# EAGLE design displayboard (EAGLE 6.4)
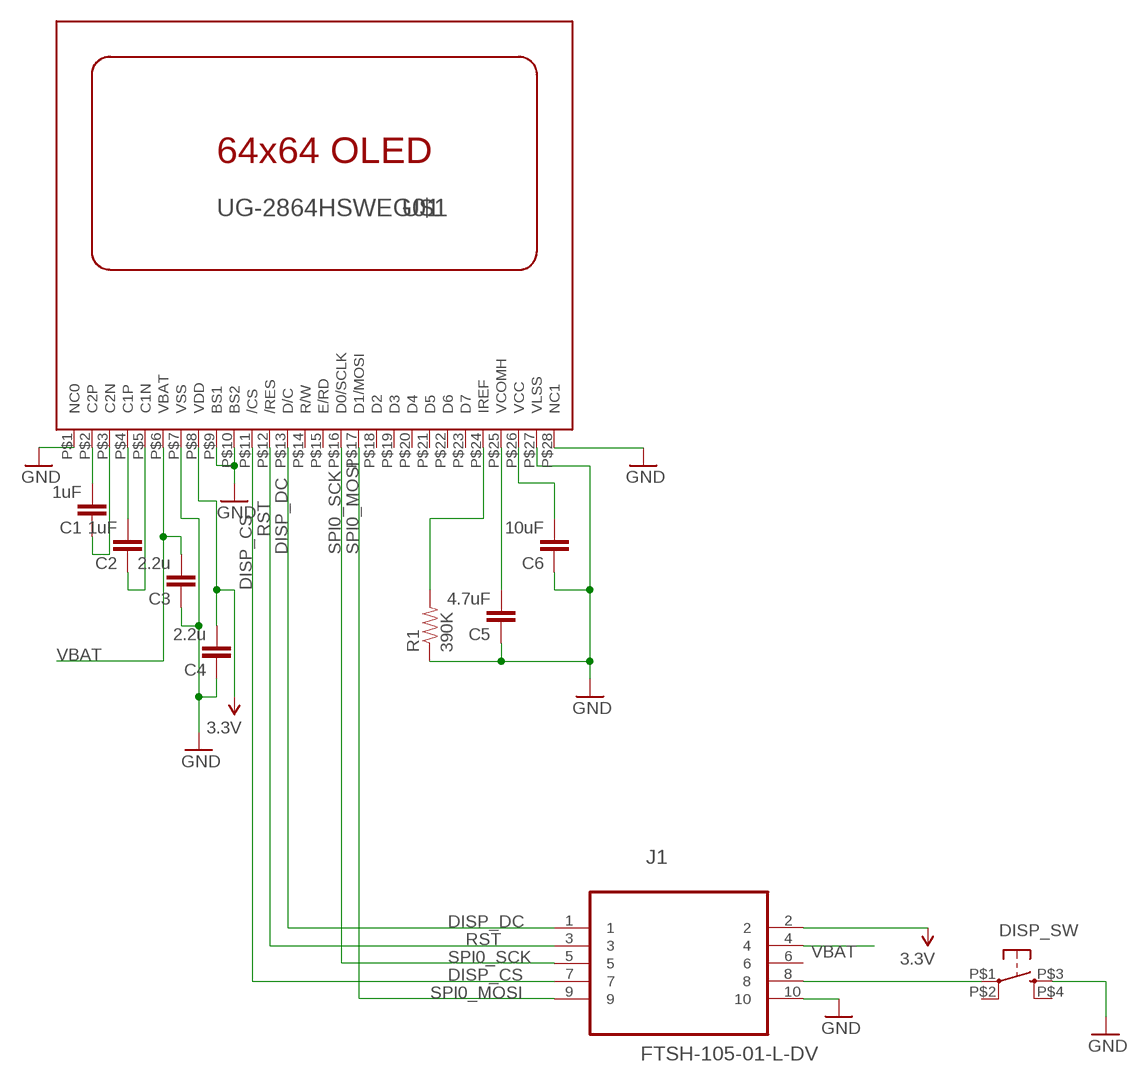
[diagram p0: schematic, sheet 1]

## Parts
C1  1uF  CAP0805  [0805]
C2  1uF  CAP0805  [0805]
C3  2.2u  CAP0805  [0805]
C4  2.2u  CAP0805  [0805]
C5  4.7uF  CAP0805  [0805]
C6  10uF  CAP0805  [0805]
DISP_SW  TAC_SWITCHKSA_SEALED  [KSA_SEALED_TAC_SWITCH]
J1  FTSH-105-01-L-DV  [SAMTEC_FTSH-105-01-L-DV]
R1  390K  RESISTOR0805-RES  [0805]
U$1  UG-2864HSWEG01  [1X28-0.32MM]

## Nets
3.3V: C4.2 J1.2 U$1.P$8(VDD)
DISP_CS: J1.7 U$1.P$11(/CS)
DISP_DC: J1.1 U$1.P$13(D/C)
DISP_SW: DISP_SW.P$1 J1.8
GND: C3.1 C4.1 C5.1 C6.1 DISP_SW.P$3 J1.10 R1.1 U$1.P$1(NC0) U$1.P$7(VSS) U$1.P$9(BS1) U$1.P$10(BS2) U$1.P$27(VLSS) U$1.P$28(NC1)
N$2: C2.1 U$1.P$5(C1N)
N$3: R1.2 U$1.P$24(IREF)
N$25: C1.2 U$1.P$2(C2P)
N$26: C6.2 U$1.P$26(VCC)
N$27: C1.1 U$1.P$3(C2N)
N$28: C5.2 U$1.P$25(VCOMH)
N$29: C2.2 U$1.P$4(C1P)
RST: J1.3 U$1.P$12(/RES)
SPI0_MOSI: J1.9 U$1.P$17(D1/MOSI)
SPI0_SCK: J1.5 U$1.P$16(D0/SCLK)
VBAT: C3.2 J1.4 U$1.P$6(VBAT)
Unconnected: DISP_SW.P$2 DISP_SW.P$4 J1.6 U$1.P$14(R/W) U$1.P$15(E/RD) U$1.P$18(D2) U$1.P$19(D3) U$1.P$20(D4) U$1.P$21(D5) U$1.P$22(D6) U$1.P$23(D7)

## Library data of the parts
C1-C6 = SparkFun-Capacitors:CAP: Capacitor Standard 0603 ceramic capacitor, and 0.1" leaded capacitor.
DISP_SW = SparkFun-Electromechanical:TAC_SWITCH: Momentary Switch Button commonly used for reset or general input. Spark Fun Electronics SKU : COM-00097 SMT- SWCH-08247
J1 = SAMTEC-HTSW-FTxx_By_element14_Batch_1:FTSH-105-01-L-DV: CONN HEADER, 1.27MM, 2X5WAY, SMT; MPN: FTSH-105-01-L-DV; OC_FARNELL: 1667759; OC_NEWARK: 11P4814; PACKAGE: HEADER, 1.27MM, 2X5WAY, SMT; SUPPLIER: SAMTEC
R1 = SparkFun-Passives:RESISTOR: Resistor Basic schematic elements and footprints for 0603, 1206, and PTH resistors.
U$1 = adafruit:UG-2864HSWEG01: UG-2864HSWEG01 OLED display

## Board
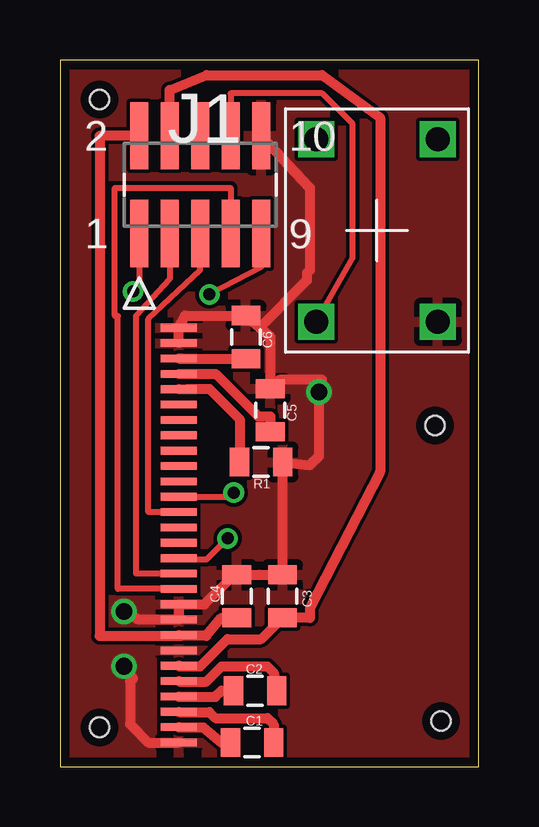
[diagram p1: board, top side]
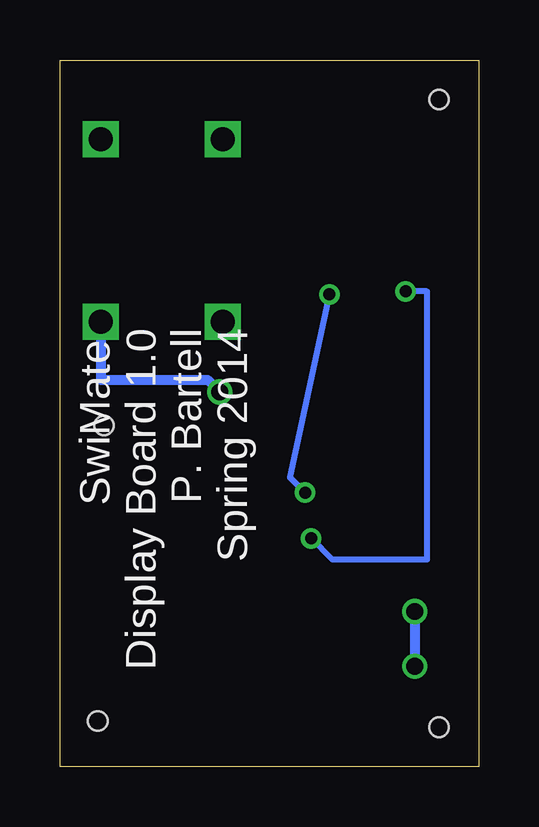
[diagram p2: board, bottom side, seen from below]

Size 17.45 x 29.45 mm. Coordinates in mm from the lower left corner, seen from the top.
Outline: 0,0 17.45,0 17.45,29.45 0,29.45 0,0
Copper layers (1*16): Top 0.0356mm / dielectric 1.5011mm / Bottom 0.0356mm
Design rules "LaenPCBOrder": minimum track width 6mil, minimum drill 13mil, track to track 6mil, track to pad 6mil, pad to pad 6mil, via to via 6mil, smd to smd 6mil, copper to edge 15mil, drill to drill 6mil, minimum pad ring 7mil, minimum via ring 7mil, stop-mask expansion 3mil, vias tented up to drill 0mil, thermal gap 10mil
Holes 0.8 mm at 1.65,1.65 15.88,1.91 15.62,14.22 1.65,27.81

### Footprints (pad centres in the part's own frame; a part is rotated, then mirrored left to right if it is on the bottom)
0805 = smd 0.8 x 1.2: 1 -0.9,0; 2 0.9,0
KSA_SEALED_TAC_SWITCH = drill 1 square: P$1 -3.81,2.54; P$2 3.81,2.54; P$3 -3.81,-2.54; P$4 3.81,-2.54
SAMTEC_FTSH-105-01-L-DV = smd 0.762 x 2.794: 1 -2.54,-2.032; 2 -2.54,2.032; 3 -1.27,-2.032; 4 -1.27,2.032; 5 0,-2.032; 6 0,2.032; 7 1.27,-2.032; 8 1.27,2.032; 9 2.54,-2.032; 10 2.54,2.032
1X28-0.32MM = smd 0.32 x 1.5: P$1 0,0; P$2 0.64,0; P$3 1.28,0; P$4 1.92,0; P$5 2.56,0; P$6 3.2,0; P$7 3.84,0; P$8 4.48,0; P$9 5.12,0; P$10 5.76,0; P$11 6.4,0; P$12 7.04,0; P$13 7.68,0; P$14 8.32,0; P$15 8.96,0; P$16 9.6,0; P$17 10.24,0; P$18 10.88,0; P$19 11.52,0; P$20 12.16,0; P$21 12.8,0; P$22 13.44,0; P$23 14.08,0; P$24 14.72,0; P$25 15.36,0; P$26 16,0; P$27 16.64,0; P$28 17.28,0

### Placement (x,y rotation side)
C1  8,1.02 180 top
C2  8.13,3.17 180 top
C3  9.27,7.11 270 top
C4  7.37,7.11 270 top
C5  8.76,14.86 270 top
C6  7.75,17.91 270 top
DISP_SW  13.21,22.35 90 top
J1  5.84,24.26 0 top
R1  8.38,12.7 180 top
U$1  4.95,1.02 90 top

### Tracks (layer width: path | path; a pad name or v marks a point on that pad's centre or on a via)
3.3V
  Top 0.406: C4.2 6.72,6.21 6.1,5.46 5.04,5.46 U$1.P$8 4.95,5.46 1.65,5.46 1.65,26.29 J1.2
DISP_CS
  Top 0.254: U$1.P$11 2.41,7.42 2.41,18.8 2.29,18.8 2.29,24.13 7.11,24.13 J1.7
DISP_DC  (via drill 0.5)
  Top 0.254: J1.1 3.3,19.81 v3.05,19.81 | v6.99,9.53 6.1,8.64 5.01,8.64 U$1.P$13
  Bottom 0.254: v3.05,19.81 2.16,19.81 2.16,8.64 6.1,8.64 v6.99,9.53
DISP_SW
  Top 0.254: DISP_SW.P$1 12.19,21.21 12.19,26.8 10.92,28.07 7.11,28.07 J1.8
GND  (via drill 0.7)
  Top 0.406: U$1.P$27 U$1.P$28 5.21,18.81 C6.1 8.32,18.31 | 8.32,18.31 8.76,17.92 C5.1 9.13,16.13 10.92,16.13 10.79,16 v10.79,15.62 10.79,12.95 10.41,12.57 R1.1 9.27,12.56 C3.1 C4.1 7.25,8.01 6.01,6.78 U$1.P$10 U$1.P$9 3.26,6.14 v2.67,6.48 | J1.10 10.41,24.13 10.41,20.7 10.29,20.57 10.29,20.28 8.32,18.31 | v2.67,4.19 3.05,3.68 2.92,3.56 2.92,1.78 3.68,1.02 U$1.P$1
  Bottom 0.406: v2.67,6.48 v2.67,4.19 | DISP_SW.P$3 15.75,16.13 11.3,16.13 v10.79,15.62
  pour Top: 0.25,0.25 17.91,0.25 17.14,29.08 0.51,29.08
N$2
  Top 0.406: U$1.P$5 4.97,3.56 6.1,3.56 6.73,4.19 8.64,4.19 8.9,3.93 C2.1
N$3
  Top 0.406: U$1.P$24 5.32,15.75 6.22,15.75 7.48,14.49 R1.2
N$25
  Top 0.406: U$1.P$2 5.97,1.65 6.73,1.02 C1.2
N$26
  Top 0.406: U$1.P$26 5.09,17.01 C6.2
N$27
  Top 0.406: U$1.P$3 4.96,2.29 6.22,2.29 6.48,2.03 8.64,2.03 8.9,1.77 C1.1
N$28
  Top 0.406: U$1.P$25 6.48,16.38 8.26,14.61 8.76,14.61 C5.2
N$29
  Top 0.406: U$1.P$4 4.97,2.92 6.48,2.92 6.73,3.17 C2.2
RST
  Top 0.254: J1.3 4.57,20.32 3.17,18.8 3.17,8.06 U$1.P$12
SPI0_MOSI  (via drill 0.5)
  Top 0.254: J1.9 8.38,20.83 v6.22,19.69 | U$1.P$17 7.07,11.26 v7.24,11.43
  Bottom 0.254: v6.22,19.69 7.87,12.06 v7.24,11.43
SPI0_SCK
  Top 0.254: U$1.P$16 3.68,10.62 3.68,18.67 5.84,20.7 J1.5
VBAT
  Top 0.406: U$1.P$6 4.98,4.19 5.84,4.19 6.97,5.32 8.38,5.32 C3.2 10.41,6.21 10.41,6.6 13.34,12.31 13.34,27.05 10.92,28.83 6.1,28.83 4.57,28.19 J1.4

### Text on the board
_bsilk: SwiMate / Display Board 1.0 / P. Bartell / Spring 2014